# EAGLE schematic switch matrix circuit (EAGLE 9.0.1)
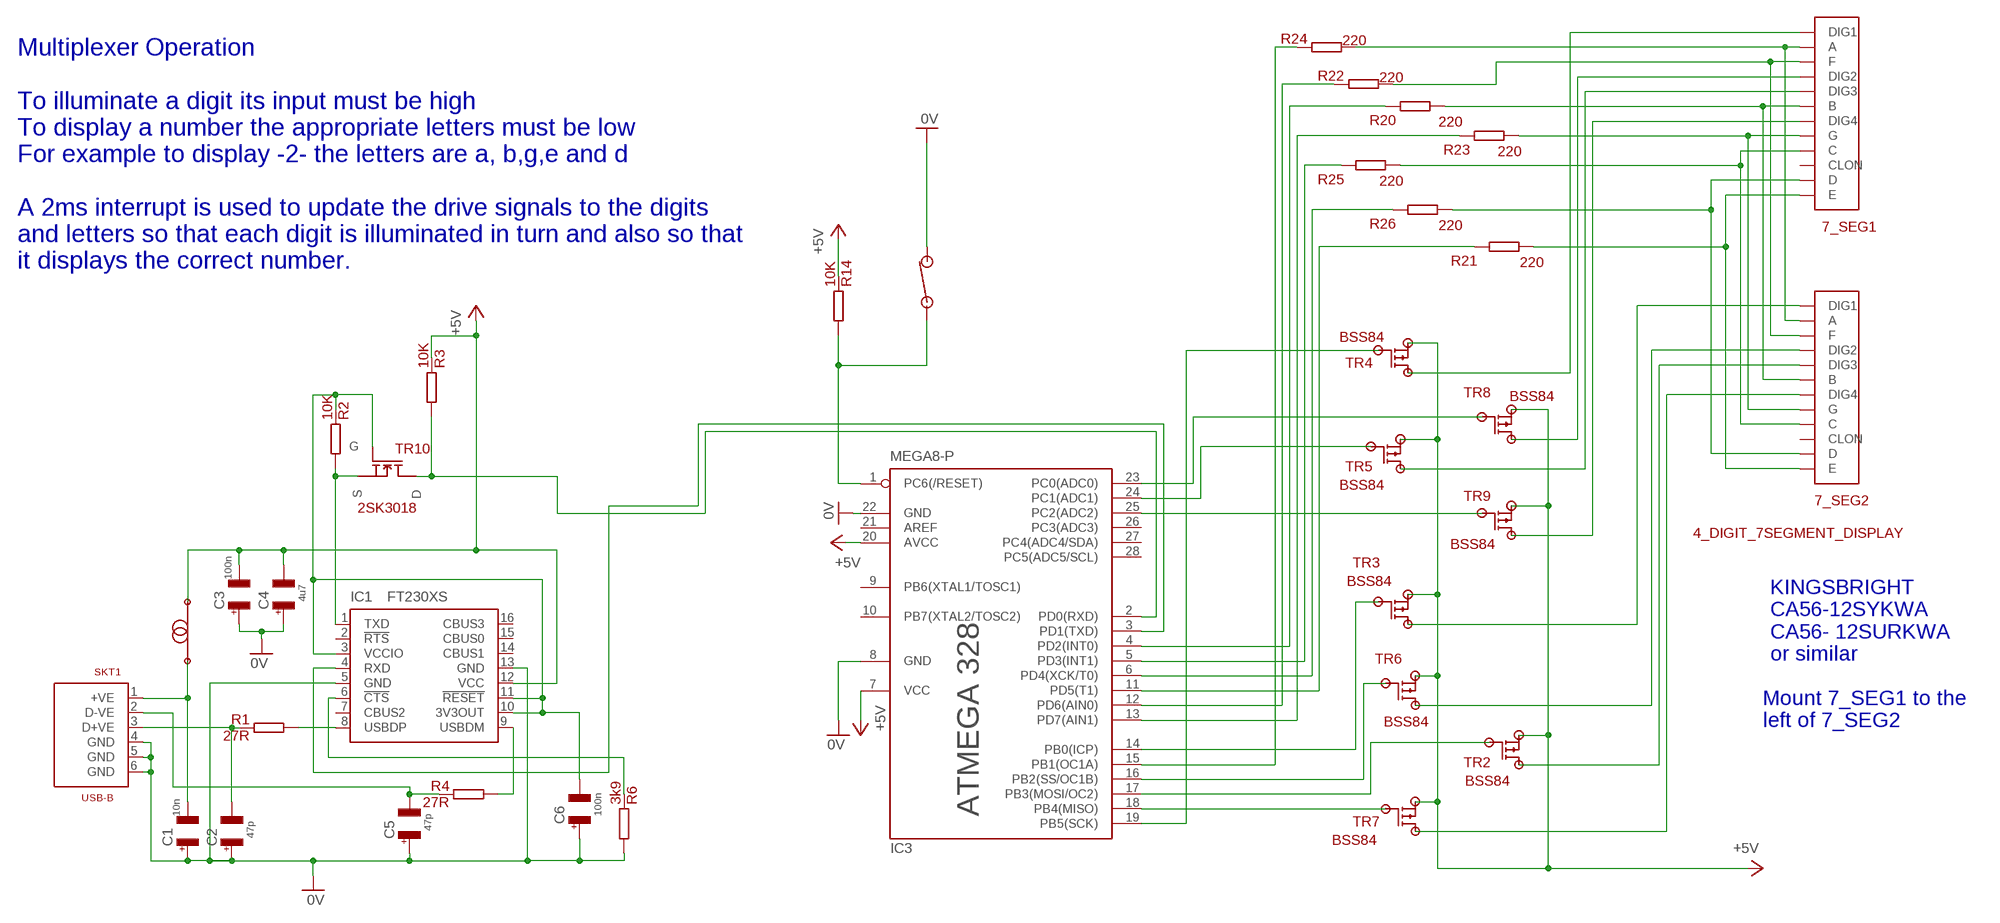
[diagram p0: schematic, sheet 1]

## Parts
7_SEG1  4_DIGIT_7SEGMENT_DISPLAY  [4_DIGIT_7SEGMENT_DISPLAY]
7_SEG2  4_DIGIT_7SEGMENT_DISPLAY  [4_DIGIT_7SEGMENT_DISPLAY]
C1  10n  1206C  [1206]
C2  47p  1206C  [1206]
C3  100n  1206C  [1206]
C4  4u7  1206C  [1206]
C5  47p  1206C  [1206]
C6  100n  1206C  [1206]
IC1  FT230XS  [SSOP16]
IC3  MEGA8-P  [DIL28-3]
L1  CHOKE  [1206]
R1  27R  1206R  [1206]
R2  10K  1206R  [1206]
R3  10K  1206R  [1206]
R4  27R  1206R  [1206]
R6  3k9  1206R  [1206]
R14  10K  1206R  [1206]
R20  220  1206R  [1206]
R21  220  1206R  [1206]
R22  220  1206R  [1206]
R23  220  1206R  [1206]
R24  220  1206R  [1206]
R25  220  1206R  [1206]
R26  220  1206R  [1206]
SKT1  USB-B  [USB-B]
SW2  NO_SW  [SM_NO_PUSH_BUTTON]
TR2  BSS84  [SOT23]
TR3  BSS84  [SOT23]
TR4  BSS84  [SOT23]
TR5  BSS84  [SOT23]
TR6  BSS84  [SOT23]
TR7  BSS84  [SOT23]
TR8  BSS84  [SOT23]
TR9  BSS84  [SOT23]
TR10  2SK3018  [2SK3018]

## Nets
0V: C1.P$1 C2.P$1 C3.P$1 C4.P$1 C5.P$1 C6.P$1 IC1.5(GND) IC1.13(GND) IC3.8(GND) IC3.22(GND) R6.P$1 SKT1.4(GND) SKT1.5(GND) SKT1.6(GND) SW2.P$2
+5V: C3.P$2 C4.P$2 IC1.12(VCC) IC3.7(VCC) IC3.20(AVCC) L1.P$2 R3.P$2 R14.P$2 TR2.2(S) TR3.2(S) TR4.2(S) TR5.2(S) TR6.2(S) TR7.2(S) TR8.2(S) TR9.2(S)
DIGIT0: 7_SEG1.P$12(DIG1) TR4.3(D)
DIGIT4: 7_SEG2.P$12(DIG1) TR3.3(D)
DIGIT5: 7_SEG2.P$9(DIG2) TR6.3(D)
DIGIT6: 7_SEG2.P$8(DIG3) TR2.3(D)
DIGIT7: 7_SEG2.P$6(DIG4) TR7.3(D)
DISPLAY_DRIVER0: IC3.15(PB1(OC1A)) R24.P$2
DISPLAY_DRIVER1: IC3.4(PD2(INT0)) R20.P$2
DISPLAY_DRIVER2: IC3.5(PD3(INT1)) R25.P$2
DISPLAY_DRIVER3: IC3.6(PD4(XCK/T0)) R26.P$2
DISPLAY_DRIVER4: IC3.11(PD5(T1)) R21.P$2
DISPLAY_DRIVER5: IC3.12(PD6(AIN0)) R22.P$2
DISPLAY_DRIVER6: IC3.13(PD7(AIN1)) R23.P$2
DISPLAY_DRIVER8: IC3.14(PB0(ICP)) TR3.1(G)
DISPLAY_DRIVER9: IC3.16(PB2(SS/OC1B)) TR6.1(G)
DISPLAY_DRIVER10: IC3.17(PB3(MOSI/OC2)) TR2.1(G)
DISPLAY_DRIVER11: IC3.18(PB4(MISO)) TR7.1(G)
DISPLAY_DRIVER12: IC3.19(PB5(SCK)) TR4.1(G)
DISPLAY_DRIVER13: IC3.23(PC0(ADC0)) TR8.1(G)
DISPLAY_DRIVER14: IC3.24(PC1(ADC1)) TR5.1(G)
N$1: 7_SEG1.P$9(DIG2) TR8.3(D)
N$2: 7_SEG1.P$8(DIG3) TR5.3(D)
N$3: 7_SEG1.P$6(DIG4) TR9.3(D)
N$4: IC3.25(PC2(ADC2)) TR9.1(G)
N$6: IC1.4(RXD) IC3.3(PD1(TXD))
N$9: C6.P$2 IC1.3(VCCIO) IC1.10(3V3OUT) IC1.11(!RESET) R2.P$2 TR10.2(G)
N$15: IC1.1(TXD) R2.P$1 TR10.1(S)
N$18: IC1.9(USBDM) R4.P$1
N$25: IC1.8(USBDP) R1.P$1
N$27: C5.P$2 R4.P$2 SKT1.2(D-VE)
N$29: C2.P$2 R1.P$2 SKT1.3(D+VE)
N$30: C1.P$2 L1.P$1 SKT1.1(+VE)
N$31: IC3.1(PC6(/RESET)) R14.P$1 SW2.P$1
N$34: IC1.6(!CTS) R6.P$2
N$40: IC3.2(PD0(RXD)) R3.P$1 TR10.3(D)
SEVEN_SEG0: 7_SEG1.P$11(A) 7_SEG2.P$11(A) R24.P$1
SEVEN_SEG1: 7_SEG1.P$7(B) 7_SEG2.P$7(B) R20.P$1
SEVEN_SEG2: 7_SEG1.P$4(C) 7_SEG2.P$4(C) R25.P$1
SEVEN_SEG3: 7_SEG1.P$2(D) 7_SEG2.P$2(D) R26.P$1
SEVEN_SEG4: 7_SEG1.P$1(E) 7_SEG2.P$1(E) R21.P$1
SEVEN_SEG5: 7_SEG1.P$10(F) 7_SEG2.P$10(F) R22.P$1
SEVEN_SEG6: 7_SEG1.P$5(G) 7_SEG2.P$5(G) R23.P$1
Unconnected: 7_SEG1.P$3(CLON) 7_SEG2.P$3(CLON) IC1.2(!RTS) IC1.7(CBUS2) IC1.14(CBUS1) IC1.15(CBUS0) IC1.16(CBUS3) IC3.9(PB6(XTAL1/TOSC1)) IC3.10(PB7(XTAL2/TOSC2)) IC3.21(AREF) IC3.26(PC3(ADC3)) IC3.27(PC4(ADC4/SDA)) IC3.28(PC5(ADC5/SCL))

## Notes on the sheet
- Multiplexer Operation
  
  To illuminate a digit its input must be high
  To display a number the appropriate letters must be low
  For example to display -2- the letters are a, b,g,e and d 
  
  A 2ms interrupt is used to update the drive signals to the digits
  and letters so that each digit is illuminated in turn and also so that
  it displays the correct number.
- KINGSBRIGHT
  CA56-12SYKWA
  CA56- 12SURKWA
  or similar
- Mount 7_SEG1 to the
  left of 7_SEG2
- ATMEGA 328

## Library data of the parts
7_SEG1 7_SEG2 = 1_marko:4_DIGIT_7SEGMENT_DISPLAY: Common Anode RE 55-1674
C1-C6 = 1_Home_library:1206C: 4.7uF RS 538-2335 100nF RS 264-4179
IC1 = 1_3V3_Bootloader:FT230X: USB to BASIC UART IC RS 757-0010
IC3 = 1_Home_library:MEGA8-P: MICROCONTROLLER 8 Kbytes FLASH, 1 kbytes SRAM, 512 bytes EEPROM, USART, 4-channel 10 bit ADC, 2-channel 8 bit ADC Pin compatible with Atmega48, ATMega88, ATMega168 Source: avr.lbr; OC_FARNELL: unknown; OC_NEWARK: unknown
L1 = 1_Home_library:CHOKE: RS 724-1582 1206 inductor
R1-R4 R6 R14 R20-R26 = 1_Home_library:1206R
SKT1 = 3_My_prog:USB-B: RS 515-1967
SW2 = 1_Home_library:NO_SW: SM NO push button RE 51-0709
TR2-TR9 = 1_3V3_Bootloader:BSS84: RS 436-8091P
TR10 = 1_3V3_Bootloader:2SK3018: SM equivalent of 2N7000 RS 694-2812